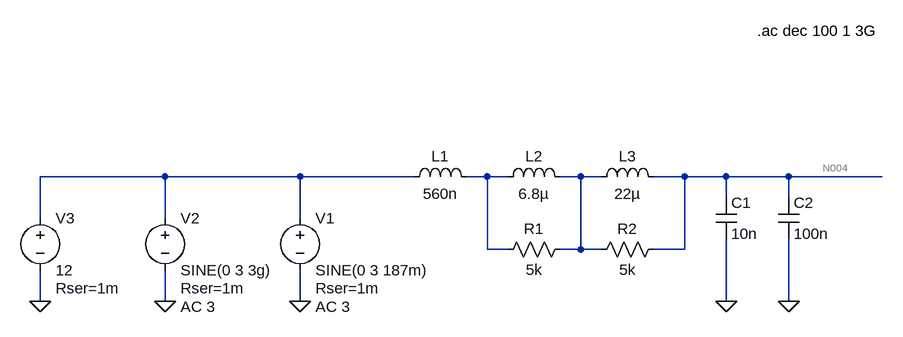
[diagram p0: schematic Serializer_POC.asc]
Serializer_POC.asc, the LTspice schematic file:
Version 4.1
SHEET 1 880 680
WIRE -288 128 -480 128
WIRE -80 128 -288 128
WIRE 96 128 -80 128
WIRE 208 128 176 128
WIRE 240 128 208 128
WIRE 352 128 320 128
WIRE 384 128 352 128
WIRE 512 128 464 128
WIRE 576 128 512 128
WIRE 672 128 576 128
WIRE 816 128 672 128
WIRE 576 160 576 128
WIRE 672 160 672 128
WIRE -480 192 -480 128
WIRE -288 192 -288 128
WIRE -80 192 -80 128
WIRE 208 240 208 128
WIRE 240 240 208 240
WIRE 352 240 352 128
WIRE 352 240 320 240
WIRE 384 240 352 240
WIRE 512 240 512 128
WIRE 512 240 464 240
WIRE -480 320 -480 272
WIRE -288 320 -288 272
WIRE -80 320 -80 272
WIRE 576 320 576 224
WIRE 672 320 672 224
FLAG -80 320 0
FLAG 576 320 0
FLAG 672 320 0
FLAG -288 320 0
FLAG -480 320 0
SYMBOL ind 80 144 R270
WINDOW 0 32 56 VTop 2
WINDOW 3 5 56 VBottom 2
SYMATTR InstName L1
SYMATTR Value 560n
SYMATTR SpiceLine Rser=120m Cpar=0.126p
SYMBOL ind 224 144 R270
WINDOW 0 32 56 VTop 2
WINDOW 3 5 56 VBottom 2
SYMATTR InstName L2
SYMATTR Value 6.8µ
SYMATTR SpiceLine Rser=130 Cpar=0.190p
SYMBOL ind 368 144 R270
WINDOW 0 32 56 VTop 2
WINDOW 3 5 56 VBottom 2
SYMATTR InstName L3
SYMATTR Value 22µ
SYMATTR SpiceLine Rser=495m Cpar=2.879p
SYMBOL cap 560 160 R0
SYMATTR InstName C1
SYMATTR Value 10n
SYMBOL cap 656 160 R0
SYMATTR InstName C2
SYMATTR Value 100n
SYMBOL res 336 224 R90
WINDOW 0 0 56 VBottom 2
WINDOW 3 32 56 VTop 2
SYMATTR InstName R1
SYMATTR Value 5k
SYMBOL res 480 224 R90
WINDOW 0 0 56 VBottom 2
WINDOW 3 32 56 VTop 2
SYMATTR InstName R2
SYMATTR Value 5k
SYMBOL voltage -80 176 R0
WINDOW 123 24 152 Left 2
WINDOW 39 24 124 Left 2
SYMATTR Value2 AC 3
SYMATTR SpiceLine Rser=1m
SYMATTR InstName V1
SYMATTR Value SINE(0 3 187m)
SYMBOL voltage -288 176 R0
WINDOW 123 24 152 Left 2
WINDOW 39 24 124 Left 2
SYMATTR Value2 AC 3
SYMATTR SpiceLine Rser=1m
SYMATTR InstName V2
SYMATTR Value SINE(0 3 3g)
SYMBOL voltage -480 176 R0
WINDOW 123 0 0 Left 0
WINDOW 39 24 124 Left 2
SYMATTR SpiceLine Rser=1m
SYMATTR InstName V3
SYMATTR Value 12
TEXT 624 -96 Left 2 !.ac dec 100 1 3G

The netlist it stands for:
* Serializer_POC.asc
L1 N001 N002 560n Rser=120m Cpar=0.126p
L2 N002 N003 6.8µ Rser=130 Cpar=0.190p
L3 N003 N004 22µ Rser=495m Cpar=2.879p
C1 N004 0 10n
C2 N004 0 100n
R1 N003 N002 5k
R2 N004 N003 5k
V1 N001 0 SINE(0 3 187m) AC 3 Rser=1m
V2 N001 0 SINE(0 3 3g) AC 3 Rser=1m
V3 N001 0 12 Rser=1m
.ac dec 100 1 3G
.backanno
.end

* Results of the author's LTspice run, read from the files saved beside the schematic
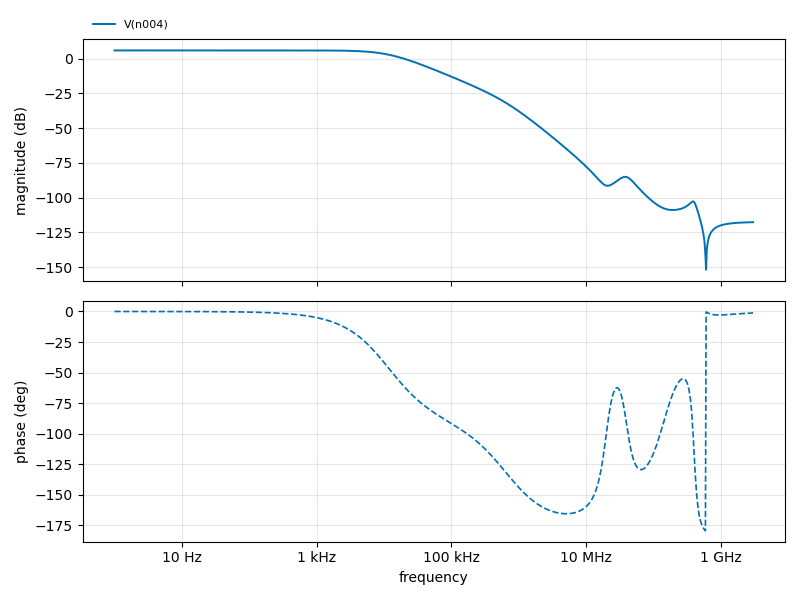
[diagram p1: AC Analysis of Serializer_POC.asc, plotted from the saved traces]
* AC Analysis, 1 run:
*   V(n004): 6.02 dB at 1 Hz, -117.65 dB at 3 GHz, peak 6.02 dB at 1 Hz, 3 dB below the peak at 11.55 kHz